# EAGLE design kelvin_ntc_B (EAGLE 6.6.0)
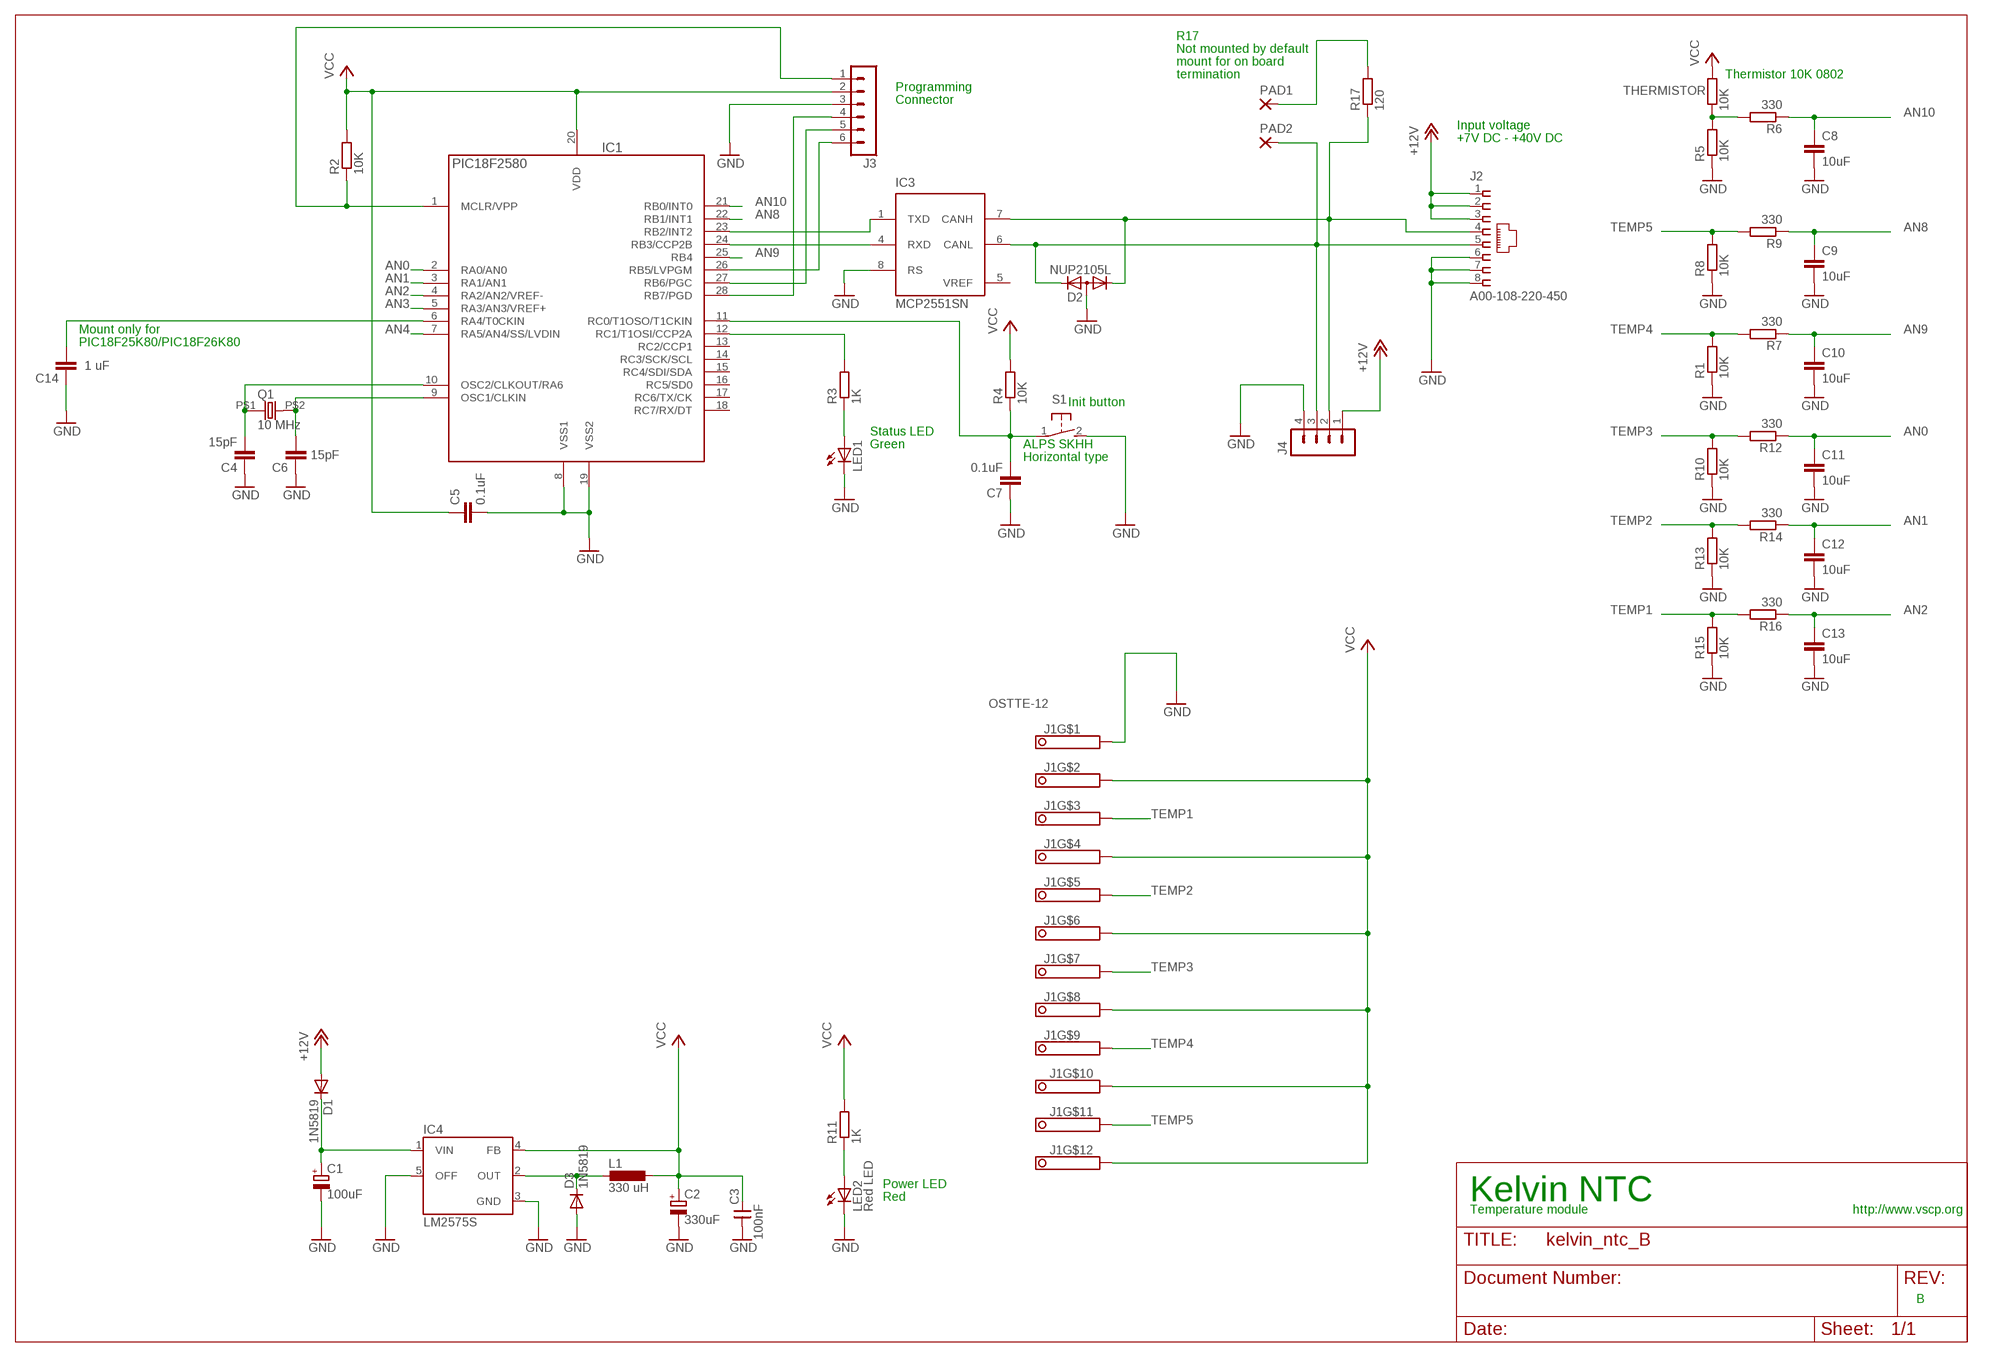
[diagram p0: schematic, sheet 1]

## Parts
C1  100uF  CPOL-EUD  [PANASONIC_D]
C2  330uF  CPOL-EUD  [PANASONIC_D]
C3  100nF  CNP-0805  [0805]
C4  15pF  C-EUC0805  [C0805]
C5  0.1uF  C-EUC0805  [C0805]
C6  15pF  C-EUC0805  [C0805]
C7  0.1uF  C-EUC0805  [C0805]
C8  10uF  C-EUC0805  [C0805]
C9  10uF  C-EUC0805  [C0805]
C10  10uF  C-EUC0805  [C0805]
C11  10uF  C-EUC0805  [C0805]
C12  10uF  C-EUC0805  [C0805]
C13  10uF  C-EUC0805  [C0805]
C14  1 uF  C-EUC0805  [C0805]
D1  1N5819  DIODE-SOD123  [SOD123]
D2  NUP2105L  DIODE-2CA|ACSOT23  [SOT23]
D3  1N5819  DIODE-SOD123  [SOD123]
IC1  PIC18F2580  PIC18LF252-I/SO  [SO28]
IC3  MCP2551SN  [SO-08]
IC4  LM2575S  [TO263-5]
J1  OSTTE-12  [PINHEAD-12]
J2  A00-108-220-450  [RJ-45]
J3  MA06-1  [MA06-1]
J4  MA04-1  [MA04-1]
L1  330 uH  DO3316P  [DO3316P]
LED1  LEDCHIP-LED0805  [CHIP-LED0805]
LED2  Red LED  LEDCHIP-LED0805  [CHIP-LED0805]
PAD1  1,6/0,8  [1,6/0,8]
PAD2  1,6/0,8  [1,6/0,8]
Q1  10 MHz  HC-49S  [9C]
R1  10K  R-EU_R0805  [R0805]
R2  10K  R-EU_R0805  [R0805]
R3  1K  R-EU_R0805  [R0805]
R4  10K  R-EU_R0805  [R0805]
R5  10K  R-EU_R0805  [R0805]
R6  330  R-EU_R0805  [R0805]
R7  330  R-EU_R0805  [R0805]
R8  10K  R-EU_R0805  [R0805]
R9  330  R-EU_R0805  [R0805]
R10  10K  R-EU_R0805  [R0805]
R11  1K  R-EU_R0805  [R0805]
R12  330  R-EU_R0805  [R0805]
R13  10K  R-EU_R0805  [R0805]
R14  330  R-EU_R0805  [R0805]
R15  10K  R-EU_R0805  [R0805]
R16  330  R-EU_R0805  [R0805]
R17  120  R-EU_R0805  [R0805]
S1  31-XX  [B3F-31XX]
THERMISTOR  10K  R-EU_R0805  [R0805]

## Nets
+12V: D1.A J2.1 J2.2 J2.3 J4.1
AN0: C11.1 IC1.2(RA0/AN0) R12.1
AN1: C12.1 IC1.3(RA1/AN1) R14.1
AN2: C13.1 IC1.4(RA2/AN2/VREF-) R16.1
AN3: IC1.5(RA3/AN3/VREF+)
AN4: IC1.7(RA5/AN4/SS/LVDIN)
AN8: C9.1 IC1.22(RB1/INT1) R9.1
AN9: C10.1 IC1.25(RB4) R7.1
AN10: C8.1 IC1.21(RB0/INT0) R6.1
CANH: D2.1(K1) IC3.7(CANH) J2.4 J4.2 R17.1
CANL: D2.2(K2) IC3.6(CANL) J2.5 J4.3 PAD2.1(P)
GND: C1.- C2.- C3.1 C4.1 C5.2 C6.1 C7.1 C8.2 C9.2 C10.2 C11.2 C12.2 C13.2 C14.1 D2.3(A) D3.A IC1.8(VSS1) IC1.19(VSS2) IC3.8(RS) IC4.3(GND) IC4.5(OFF) J1.1 J2.6 J2.7 J2.8 J3.3 J4.4 LED1.C LED2.C R1.1 R5.1 R8.1 R10.1 R13.1 R15.1 S1.2(S)
N$1: D3.C IC4.2(OUT) L1.1
N$2: C4.2 IC1.10(OSC2/CLKOUT/RA6) Q1.P$1
N$3: C1.+ D1.C IC4.1(VIN)
N$4: IC1.12(RC1/T1OSI/CCP2A) R3.2
N$5: LED1.A R3.1
N$6: C7.2 IC1.11(RC0/T1OSO/T1CKIN) R4.1 S1.1(P)
N$7: C6.2 IC1.9(OSC1/CLKIN) Q1.P$2
N$8: R5.2 R6.2 THERMISTOR.1
N$9: C14.2 IC1.6(RA4/T0CKIN)
N$11: PAD1.1(P) R17.2
N$12: IC1.1(MCLR/VPP) J3.1 R2.1
N$13: IC1.28(RB7/PGD) J3.4
N$14: IC1.27(RB6/PGC) J3.5
N$15: IC1.26(RB5/LVPGM) J3.6
N$20: LED2.A R11.1
RXCAN: IC1.24(RB3/CCP2B) IC3.4(RXD)
TEMP1: J1.3 R15.2 R16.2
TEMP2: J1.5 R13.2 R14.2
TEMP3: J1.7 R10.2 R12.2
TEMP4: J1.9 R1.2 R7.2
TEMP5: J1.11 R8.2 R9.2
TXCAN: IC1.23(RB2/INT2) IC3.1(TXD)
VCC: C2.+ C3.2 C5.1 IC1.20(VDD) IC4.4(FB) J1.2 J1.4 J1.6 J1.8 J1.10 J1.12 J3.2 L1.2 R2.2 R4.2 R11.2 THERMISTOR.2
Unconnected: IC1.13(RC2/CCP1) IC1.14(RC3/SCK/SCL) IC1.15(RC4/SDI/SDA) IC1.16(RC5/SD0) IC1.17(RC6/TX/CK) IC1.18(RC7/RX/DT)

## Notes on the sheet
- R17
- Not mounted by default
- mount for on board
- termination | Thermistor 10K 0802
- Programming
- Connector
- Input voltage
- +7V DC - +40V DC
- Mount only for
- PIC18F25K80/PIC18F26K80
- Init button
- Status LED
- Green | ALPS SKHH
- Horizontal type
- Power LED
- Red | Kelvin NTC
- Temperature module | http://www.vscp.org
- B

## Power pins joined to a net without a drawn wire
GND: IC3.2(VSS)
VCC: IC3.3(VDD)
VREF: IC3.5(VREF)

## Library data of the parts
C1 C2 = rcl:CPOL-EU: POLARIZED CAPACITOR, European symbol
C3 = cap-master:CNP-: NON-POLARIZED CAP
C4-C14 = rcl:C-EU: CAPACITOR, European symbol
D1 D3 = diode:DIODE-: DIODE
D2 = diode:DIODE-2CA|AC: Dual DIODE Cathode-Anode|Anode-Cathode
IC1 = pic_olin:PIC18*F252-?: 18F252, 28 pin, 32Kb prog, 1536 data, 256 EEPROM
IC3 = microchip_can:MCP2551: High Speed CAN tranceiver
IC4 = v-reg-3:LM2575: National Semiconductor <http://www.national.com> 1.0A "Simple Switcher"(c) 52kHz, Vout 1.23-37V (HV: 57V), Vin 40V (HV: 60V), 50µA standby current
J1 = vscpcan:OSTTE-12
J2 = vscpcan:A00-108-220-450
J3 = con-lstb:MA06-1: PIN HEADER; OC_FARNELL: unknown; OC_NEWARK: unknown
J4 = con-lstb:MA04-1: PIN HEADER; OC_FARNELL: unknown; OC_NEWARK: unknown
L1 = inductor-coilcraft:DO3316P: COILCRAFT; OC_FARNELL: unknown; OC_NEWARK: unknown
LED1 LED2 = led:LED: LED OSRAM: - CHIPLED LG R971, LG N971, LY N971, LG Q971, LY Q971, LO R971, LY R971 LH N974, LH R974 LS Q976, LO Q976, LY Q976 LO Q996 - Hyper CHIPLED LW Q18S LB Q993, LB Q99A, LB R99A - SideLED LS A670, LO A670, LY A670, LG A670, LP A670 LB A673, LV A673, LT A673, LW A673 LH A674 LY A675 LS A676, LA A676, LO A676, LY A676, LW A676 LS A679, LY A679, LG A679 - Hyper Micro SIDELED® LS Y876, LA Y876, LO Y876, LY Y876 LT Y87S - SmartLED LW L88C, LW L88S LB L89C, LB L89S, LG L890 LS L89K, LO L89K, LY L89K LS L896, LA L896, LO L896, LY L896 - TOPLED LS T670, LO T670, LY T670, LG T670, LP T670 LSG T670, LSP T670, LSY T670, LOP T670, LYG T670 LG T671, LOG T671, LSG T671 LB T673, LV T673, LT T673, LW T673 LH T674 LS T676, LA T676, LO T676, LY T676, LB T676, LH T676, LSB T676, LW T676 LB T67C, LV T67C, LT T67C, LS T67K, LO T67K, LY T67K, LW E67C LS E67B, LA E67B, LO E67B, LY E67B, LB E67C, LV E67C, LT E67C LW T67C LS T679, LY T679, LG T679 LS T770, LO T770, LY T770, LG T770, LP T770 LB T773, LV T773, LT T773, LW T773 LH T774 LS E675, LA E675, LY E675, LS T675 LS T776, LA T776, LO T776, LY T776, LB T776 LHGB T686 LT T68C, LB T68C - Hyper Mini TOPLED® LB M676 - Mini TOPLED Santana® LG M470 LS M47K, LO M47K, LY M47K Source: http://www.osram.convergy.de LUXEON: - LUMILED® LXK2-PW12-R00, LXK2-PW12-S00, LXK2-PW14-U00, LXK2-PW14-V00 LXK2-PM12-R00, LXK2-PM12-S00, LXK2-PM14-U00 LXK2-PE12-Q00, LXK2-PE12-R00, LXK2-PE12-S00, LXK2-PE14-T00, LXK2-PE14-U00 LXK2-PB12-K00, LXK2-PB12-L00, LXK2-PB12-M00, LXK2-PB14-N00, LXK2-PB14-P00, LXK2-PB14-Q00 LXK2-PR12-L00, LXK2-PR12-M00, LXK2-PR14-Q00, LXK2-PR14-R00 LXK2-PD12-Q00, LXK2-PD12-R00, LXK2-PD12-S00 LXK2-PH12-R00, LXK2-PH12-S00 LXK2-PL12-P00, LXK2-PL12-Q00, LXK2-PL12-R00 Source: www.luxeon.com KINGBRIGHT: KA-3528ASYC Source: www.kingbright.com
PAD1 PAD2 = wirepad:1,6/0,8: THROUGH-HOLE PAD
Q1 = vscpcan:HC-49S: Digikey 887-1050-1-nd
R1-R17 THERMISTOR = rcl:R-EU_: RESISTOR, European symbol
S1 = switch-omron:31-XX: OMRON SWITCH; MPN: B3F-3100; OC_FARNELL: 959704; OC_NEWARK: 36M3582

## Board
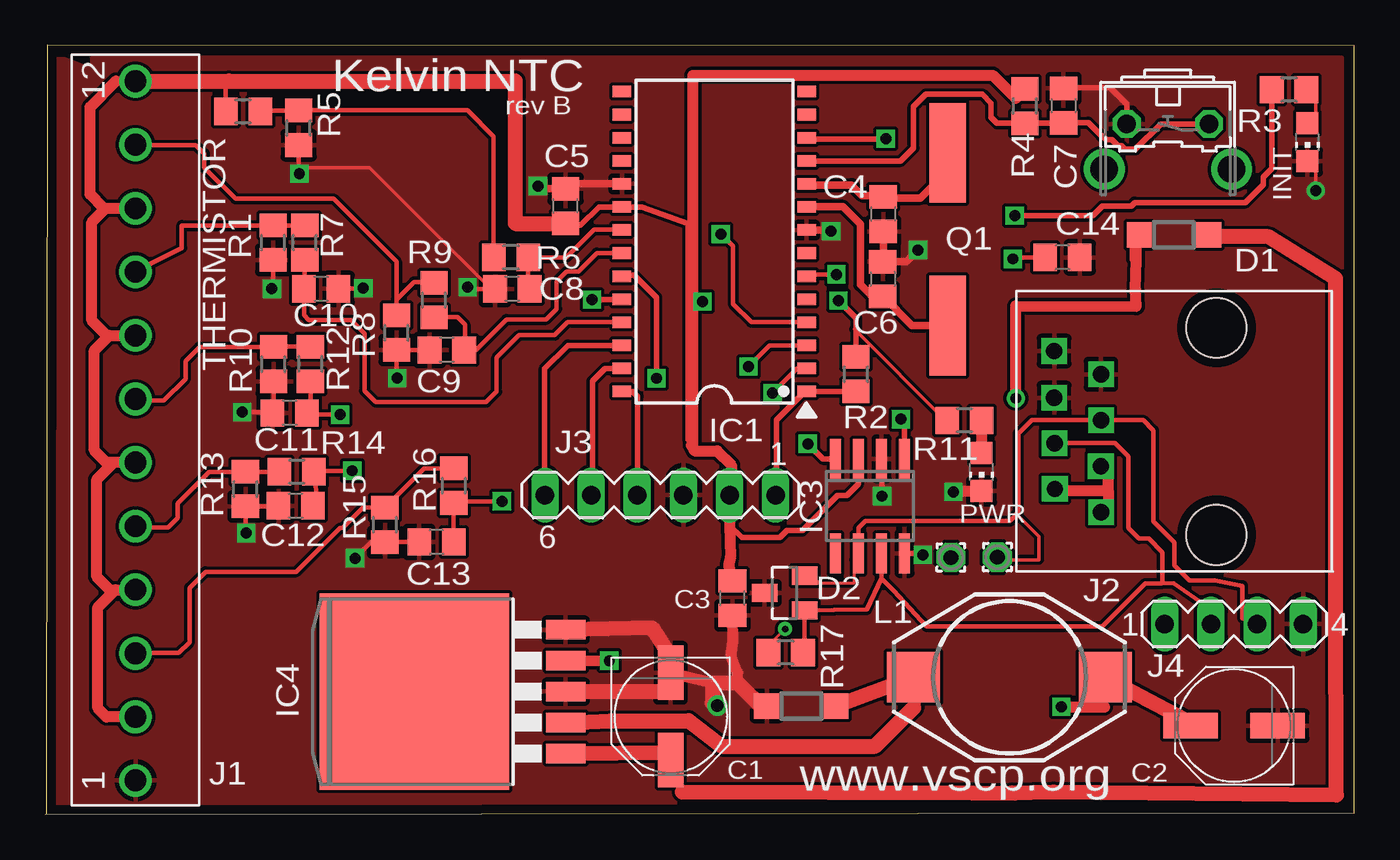
[diagram p1: board, top side]
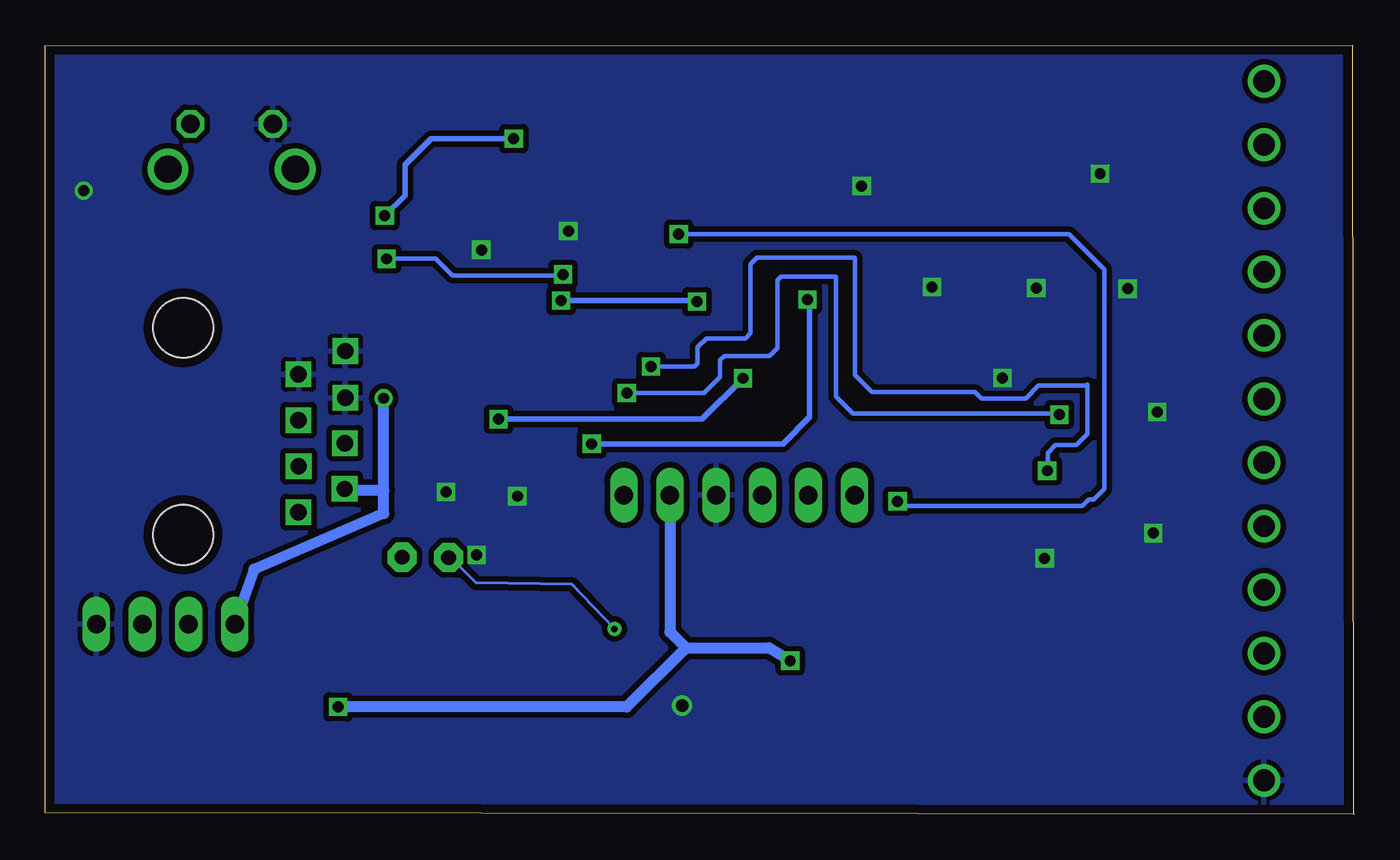
[diagram p2: board, bottom side, seen from below]

Size 72.04 x 42.34 mm. Coordinates in mm from the lower left corner, seen from the top.
Outline: 0,0 72.04,0.09 72.04,42.31 0.09,42.34 0.04,0.01
Copper layers (1*16): Top 0.0356mm / dielectric 1.5011mm / Bottom 0.0356mm
Design rules "SilverCircuits": minimum track width 7mil, minimum drill 14mil, track to track 7mil, track to pad 7mil, pad to pad 7mil, via to via 7mil, smd to smd 0mil, copper to edge 20mil, drill to drill 8mil, minimum pad ring 10mil, minimum via ring 8mil, stop-mask expansion 4mil, vias tented up to drill 0mil, thermal gap 10mil

### Footprints (pad centres in the part's own frame; a part is rotated, then mirrored left to right if it is on the bottom)
PANASONIC_D = smd 3 x 1.4: + 2.4,0; - -2.4,0
0805 = smd 1.27 x 1.524: 1 -0.953,0; 2 0.953,0
C0805 = smd 1.3 x 1.5: 1 -0.95,0; 2 0.95,0
SOD123 = smd 1.4 x 1.4: A 1.9,0; C -1.9,0
SOT23 = smd 1 x 1.4: 1 -0.95,-1.1; 2 0.95,-1.1; 3 0,1.1
SO28 = smd 0.635 x 1.016: 1 -8.255,-5.08; 2 -6.985,-5.08; 3 -5.715,-5.08; 4 -4.445,-5.08; 5 -3.175,-5.08; 6 -1.905,-5.08; 7 -0.635,-5.08; 8 0.635,-5.08; 9 1.905,-5.08; 10 3.175,-5.08; 11 4.445,-5.08; 12 5.715,-5.08; 13 6.985,-5.08; 14 8.255,-5.08; 15 8.255,5.08; 16 6.985,5.08; 17 5.715,5.08; 18 4.445,5.08; 19 3.175,5.08; 20 1.905,5.08; 21 0.635,5.08; 22 -0.635,5.08; 23 -1.905,5.08; 24 -3.175,5.08; 25 -4.445,5.08; 26 -5.715,5.08; 27 -6.985,5.08; 28 -8.255,5.08
SO-08 = smd 0.6 x 2.2: 1 -1.905,-2.6; 2 -0.635,-2.6; 3 0.635,-2.6; 4 1.905,-2.6; 5 1.905,2.6; 6 0.635,2.6; 7 -0.635,2.6; 8 -1.905,2.6
TO263-5 = smd 1.067 x 2.159: 1 -3.404,-5.791; 2 -1.702,-5.791; 3 0,-5.791; 4 1.702,-5.791; 5 3.404,-5.791 | smd 10.8 x 10.41: 6 0,2.54
PINHEAD-12 = drill 1.2: 1 -17.5,0; 2 -14,0; 3 -10.5,0; 4 -7,0; 5 -3.5,0; 6 0,0; 7 3.5,0; 8 7,0; 9 10.5,0; 10 14,0; 11 17.5,0; 12 21,0
RJ-45 = drill 0.9 square: 1 -4.45,6.35; 2 -3.17,8.89; 3 -1.92,6.36; 4 -0.65,8.91; 5 0.62,6.35; 6 1.84,8.93; 7 3.14,6.35; 8 4.42,8.93 | hole 3.3: -5.7,0; 5.7,0
MA06-1 = drill 1.016 long: 1 -6.35,0; 2 -3.81,0; 3 -1.27,0; 4 1.27,0; 5 3.81,0; 6 6.35,0
MA04-1 = drill 1.016 long: 1 -3.81,0; 2 -1.27,0; 3 1.27,0; 4 3.81,0
DO3316P = smd 2.92 x 2.79: 1 -5.28,0; 2 5.28,0
CHIP-LED0805 = smd 1.2 x 1.2: A 0,-1.05; C 0,1.05
1,6/0,8 = drill 0.813 pad 1.6 octagon: 1 0,0
9C = smd 5.5 x 2: P$1 -4.74,0; P$2 4.76,0
R0805 = smd 1.3 x 1.5: 1 -0.95,0; 2 0.95,0
B3F-31XX = drill 1.016 octagon: 1 -2.261,-1.245; 2 2.261,-1.245 | drill 1.499 pad 2.159: 3 -3.505,1.245; 4 3.505,1.245

### Placement (x,y rotation side)
C1  34.42,5.39 270 top
C2  65.44,4.89 180 top
C3  37.82,11.91 90 top
C4  46.12,33.05 90 top
C5  28.63,33.49 90 top
C6  46.09,29.48 270 top
C7  56.05,39.02 270 top
C8  25.7,28.93 180 top
C9  22.1,25.57 180 top
C10  15.18,28.94 0 top
C11  13.45,22.1 180 top
C12  13.78,16.99 180 top
C13  21.53,15 180 top
C14  55.99,30.67 180 top
D1  62.12,31.91 180 top
D2  40.69,12.19 90 top
D3  41.61,5.96 180 top
IC1  36.82,31.54 90 top
IC3  45.39,16.98 180 top
IC4  22.85,6.76 90 top
J1  4.96,19.37 90 top
J2  64.46,21.09 90 top
J3  33.85,17.58 180 top
J4  65.43,10.48 0 top
L1  53.07,7.55 0 top
LED1  69.47,37.01 180 top
LED2  51.53,18.85 180 top
PAD1  49.84,14.14 0 top
PAD2  52.41,14.16 0 top
Q1  49.66,31.68 270 top
R1  12.53,31.48 90 top
R2  44.62,24.24 90 top
R3  68.46,39.9 180 top
R4  53.92,39 90 top
R5  13.94,37.8 90 top
R6  25.63,30.67 180 top
R7  14.28,31.48 90 top
R8  19.33,26.52 90 top
R9  21.39,28.32 90 top
R10  12.56,24.79 90 top
R11  50.59,21.69 180 top
R12  14.59,24.8 90 top
R13  11.01,17.91 90 top
R14  13.83,18.86 180 top
R15  18.69,15.94 90 top
R16  22.49,18.1 90 top
R17  40.75,8.91 180 top
S1  61.79,36.77 180 top
THERMISTOR  10.88,38.7 180 top

### Tracks (layer width: path | path; a pad name or v marks a point on that pad's centre or on a via)
+12V  (via drill 0.6)
  Top 0.203: J2.2 55.96,17.83 | D1.A 59.77,31.8 59.77,30.53 60.05,30.52
  Top 0.406: D1.A 59.9,31.89
  Top 0.61: 55.96,17.83 58.5,17.83 | 58.5,17.83 58.5,19.1 J2.3 | 58.5,17.83 58.5,16.56 J2.1 | 60.09,32.02 60.05,30.52 60.01,28.91 60.05,27.96 53.42,27.99 v53.42,22.91
  Bottom 0.203: 55.96,17.83 J2.2
  Bottom 0.61: 53.42,17.83 53.42,16.56 60.55,13.49 J4.1 | 53.42,17.83 v53.42,22.91 | 53.42,17.83 55.96,17.83
AN0  (via drill 0.6)
  Top 0.254: R12.1 14.59,22.29 C11.1 14.49,22.01 v16.22,22.01 | IC1.2 41.38,24.55 v40.03,23.2
  Bottom 0.254: v40.03,23.2 35.79,23.2 34.9,24.09 34.9,25.01 34.67,25.24 32.17,25.24 31.74,25.67 31.74,29.41 31.55,29.6 28.55,29.6 28.51,29.56 28.51,23.01 27.58,22.08 16.29,22.08 v16.22,22.01
AN1  (via drill 0.6)
  Top 0.254: C12.1 14.9,16.8 14.93,16.76 14.97,17.34 R14.1 14.84,18.92 v16.89,18.92 | IC1.3 39.86,25.82 v38.7,24.66
  Bottom 0.254: v38.7,24.66 36.3,24.66 36.14,24.82 36.14,25.72 35.66,26.2 33.51,26.2 33.22,26.49 33.22,30.31 32.87,30.66 27.51,30.66 27.48,30.63 27.48,24.18 26.55,23.25 20.87,23.25 20.52,22.9 18.07,22.9 17.37,23.6 14.75,23.6 14.68,23.67 14.68,20.94 15.29,20.33 16.44,20.33 16.86,19.91 16.86,18.95 v16.89,18.92
AN2  (via drill 0.6)
  Top 0.254: C13.1 R16.1 22.58,17.24 v25.13,17.24 | IC1.4 38.85,27.1 37.85,28.1 37.85,31.28 v37.18,31.95
  Bottom 0.254: 25.04,17.15 v25.13,17.24 24.88,16.99 14.97,16.99 14.61,17.35 14.33,17.35 13.75,17.93 13.75,29.99 15.71,31.95 v37.18,31.95
AN8
  Top 0.254: IC1.22 30.36,30.91 29.34,29.89 28.69,29.89 28.14,29.34 28.14,27.83 27.56,27.25 25.38,27.25 23.7,25.57 C9.1 23.09,25.61 23.09,26.98 22.7,27.37 R9.1
AN9
  Top 0.254: IC1.25 28.73,27.1 28.03,26.39 26.08,26.39 24.84,25.15 24.84,23.28 24.26,22.7 18.19,22.7 17.57,23.32 17.57,26.47 16.83,27.21 14.5,27.21 14.23,27.48 C10.1 14.28,28.99 R7.1
AN10
  Top 0.254: IC1.21 31.7,32.21 30.2,32.21 28.66,30.67 R6.1 26.58,29 C8.1
CANH
  Top 0.254: 46.02,13 IC3.7 | 46.02,13 46.69,12.33 48.51,10.35 58.18,10.35 60.54,12.71 61.45,12.71 61.49,12.75 | 61.49,12.75 61.49,14.43 60.74,15.18 60.2,15.18 59.61,15.77 59.61,19.71 58.88,20.44 J2.4 | 61.49,12.75 62.13,12.71 63.86,11.52 J4.2 | 46.02,13 46.01,12.98 45.21,11.28 43.42,11.25 D2.1 41.79,9 R17.1
  Top 0.305: IC3.7 46,14.36
CANL
  Top 0.178: 44.53,14.02 44.53,12.75 41.99,12.75 D2.2
  Top 0.203: D2.2 42.53,12.79 | 44.53,14.02 IC3.6 | PAD2.1 52.15,14.02 54.69,14.02 54.69,15.29 53.46,16.52 53.42,16.56
  Top 0.254: J4.3 65.89,10.8 65.89,12.58 64.37,12.88 62.98,12.88 62.14,13.72 62.14,14.98 61,16.12 61,21.14 60.43,21.71 J2.5 54.29,21.71 53.56,20.98 53.56,16.61 53.46,16.52 53.1,16.15 45.14,16.15 44.75,15.76 IC3.6
GND  (via drill 0.6, 0.7)
  Top 0.203: v69.93,34.34 69.93,35.61 LED1.C | C8.2 24.21,29.26 17.86,35.61 14.05,35.61 v13.98,35.28
  Top 0.254: 36.71,7.23 36.71,7.41 | C8.2 23.34,28.93 v23.24,29.03 | R5.1 13.94,35.55 v13.98,35.28 | C9.2 R8.1 19.33,24.05 v19.36,24.02 | R1.1 12.54,28.84 v12.46,28.94 | C10.2 17.46,28.94 v17.5,28.98 | R10.1 12.56,22.16 C11.2 12.44,22.16 v10.83,22.16 | v11.05,15.49 11.01,15.53 R13.1 12.7,16.96 C12.2 | v17.04,14.1 17.93,14.99 R15.1 C13.2
  Top 0.305: IC3.8 48.22,14.38 v48.31,14.29 | v46.06,17.52 46.06,19.55 IC3.2 | S1.2 59.53,39.11 58.63,40.01 56.09,40.01 C7.1
  Top 0.406: IC1.19 28.9,34.71 C5.2 27.27,34.44 v27.11,34.6 | 46.05,32.17 C4.1 46.12,30.46 C6.1 47.39,30.43 v48.04,31.08 | IC1.8 43.18,32.17 v43.25,32.11
  Top 0.61: 34.73,6.77 34.41,6.7 34.7,7.26 34.73,7.23 | 34.73,7.23 34.78,7.18 | 34.73,7.23 C1.- | 39.5,5.83 39.41,5.93 D3.A 39.55,5.96 | C1.- 36.71,7.23 | 39.55,5.96 39.66,5.86 | 39.55,5.96 39.01,6.51 | 34.52,7.2 34.42,7.1 | C1.- 34.52,7.2 | 34.55,8.5 34.55,7.23 34.52,7.2 | 36.71,6.14 v36.99,5.99 | 38.1,7.23 38.1,7.79 37.74,8.73 37.84,9.53 C3.1 | 50.03,17.8 LED2.C
  Top 0.813: IC4.3 34.73,6.77 | 39.41,5.93 38.1,7.23 36.71,7.23 36.71,6.14 | IC4.5 33.42,10.26 34.55,8.5
  other vias: 49.98,17.75
  pour Bottom (isolate 0.305): -0.22,1.63 1.44,-1.72 71.42,-2.09 73.46,1.28 73.18,34.45 71.6,43.71 0.21,43.61 -0.71,34.03
  pour Top: 1.05,41.57 0.64,41.57 0.64,0.37 71.68,0.37 71.68,0.86 71.36,0.86 71.36,41.65 2.58,41.65 2.58,41
N$1
  Top 0.61: 47.91,5.91 47.86,5.96 L1.1 47.79,5.86 | IC4.2 28.73,5 28.61,4.94
  Top 0.813: L1.1 D3.C | 47.79,5.86 45.68,3.75 37.24,3.75 35.43,5.16 31.1,5.15 28.69,5.05 28.73,5
N$2
  Top 0.406: Q1.P$1 49.66,35.42 48.18,33.94 45.74,33.94 45.6,34.08 | 45.6,34.08 46.04,34.08 C4.2 | 45.6,34.08 44.95,34.08 44.38,34.65 41.96,34.65 IC1.10
N$3
  Top 0.406: 34.43,3.41 C1.+ 35.05,1.23 | D1.C 64.56,31.91 64.66,31.81
  Top 0.813: IC4.1 34.43,3.41 | 64.66,31.81 67.33,31.81 71.03,29.51 71.03,12.1 71.06,1.07 55.5,1.23 53.15,1.18 53.37,1.17 51.05,1.18 35.05,1.23
N$4  (via drill 0.6)
  Top 0.305: IC1.12 42,37.25 42.09,37.17 46.22,37.17 v46.26,37.21 | v53.36,32.97 57.66,32.97 58.18,33.49 59.77,33.49 59.97,33.69 66.06,33.69 67.04,34.67 67.04,35.09 67.51,35.56 R3.2
  Bottom 0.305: v46.26,37.21 50.81,37.21 52.25,35.77 52.25,34.08 v53.36,32.97
N$5
  Top 0.203: 69.93,39.42 69.93,38.15 LED1.A
  Top 0.254: 69.93,39.42 R3.1
N$6
  Top 0.305: IC1.11 41.91,35.97 47.07,35.97 47.79,36.69 47.79,38.97 48.47,39.65 51.57,39.65 52.06,39.16 52.06,38.38 52.39,38.05 R4.1 56.03,38.05 C7.2 56.07,38.09 57.4,38.09 58.15,37.34 58.21,37.34 58.41,37.14 58.7,37.14 59.03,36.81 59.22,36.81 59.41,36.62 60,36.62 61.39,38.02 S1.1
N$7
  Top 0.406: Q1.P$2 47.7,26.92 C6.2 45.49,28.53 44.86,29.16 44.86,32.5 43.91,33.45 IC1.9
N$8
  Top 0.254: THERMISTOR.1 11.88,38.75 R5.2 23.24,38.76 24.68,37.32 R6.2
N$9  (via drill 0.6)
  Top 0.254: C14.2 53.34,30.67 v53.26,30.59 | v43.55,29.73 41.99,29.73 IC1.6
  Bottom 0.254: v53.26,30.59 50.55,30.59 49.63,29.67 43.61,29.67 v43.55,29.73
N$11  (via drill 0.36)
  Top 0.178: v40.72,10.21 39.45,8.94 R17.2
  Bottom 0.178: v40.72,10.21 43.06,12.65 48.34,12.75 49.61,14.02 PAD1.1
N$12
  Top 0.305: IC1.1 R2.1 41.82,23.29 40.24,21.71 40.24,17.62 J3.1
N$13
  Top 0.305: IC1.28 32.32,23.29 32.6,23.01 32.6,17.6 J3.4
N$14
  Top 0.305: IC1.27 30.81,24.55 30.11,23.85 30.11,17.65 J3.5
N$15
  Top 0.305: IC1.26 28.76,25.82 27.49,24.55 J3.6
N$20
  Top 0.61: R11.1 LED2.A
RXCAN  (via drill 0.6)
  Top 0.305: IC3.4 42.79,19.58 v41.97,20.4 | v30.09,28.35 31.72,28.35 IC1.24
  Bottom 0.305: v41.97,20.4 31.45,20.4 29.98,21.87 29.98,28.24 v30.09,28.35
TEMP1
  Top 0.254: R16.2 20.85,19.05 R15.2 17.48,16.89 16.35,15.76 16.21,15.76 13.81,13.36 8.82,13.36 7.94,12.48 7.94,9.48 7.34,8.88 J1.3
TEMP2
  Top 0.254: R14.2 R13.2 9.01,18.86 7.27,17.12 7.27,16.33 6.75,15.81 5.02,15.81 J1.5
TEMP3
  Top 0.254: J1.7 5.05,22.78 6.51,22.78 7.71,23.98 7.71,24.97 8.48,25.74 R10.2 R12.2
TEMP4
  Top 0.254: J1.9 5.03,29.94 7.51,31.18 7.51,32.43 R1.2 R7.2
TEMP5
  Top 0.254: R9.2 21.35,29.31 20.29,29.31 19.33,28.35 R8.2 19.33,30.43 15.86,33.9 10.46,33.9 8.75,35.61 8.75,36.39 8.28,36.86 J1.11
TXCAN  (via drill 0.6)
  Top 0.305: IC3.1 47.3,21.55 v47.09,21.76 | v33.64,24.01 33.64,28.46 32.4,29.7 31.8,29.7 IC1.23
  Bottom 0.305: v47.09,21.76 35.89,21.76 v33.64,24.01
VCC  (via drill 0.6)
  Top 0.203: R11.2 49.61,21.64 44.53,26.72 44.62,26.72
  Top 0.254: 35.56,20.32 35.64,20.37 | THERMISTOR.2 9.93,40.22 10.09,40.38
  Top 0.305: C5.1 28.73,32.44 29.46,32.44 30.46,33.45 IC1.20 32.84,33.45 35.38,32.53 35.38,28.13 | 35.38,28.13 35.38,20.63 35.56,20.32 | 37.76,17.68 J3.2 | v31.04,8.46 30.94,8.41 | IC3.3 44.75,18.2 44.11,17.55 43.59,17.55 41.67,15.63 40.82,15.63 40.43,15.24 38.34,15.24 37.66,15.92 | 58.3,5.92 L1.2 | R2.2 44.62,26.72 44.62,27.33 v43.66,28.29 | v36.17,28.24 35.49,28.24 35.38,28.13
  Top 0.406: 63.13,5 C2.+ | J1.12 3.88,40.37 | 3.21,33.39 4.94,33.39 J1.10 | 3.35,26.39 4.94,26.39 J1.8 | J1.6 3.75,19.37 | 4.92,12.33 J1.4 3.85,12.37
  Top 0.61: 35.56,20.32 35.74,20.01 36.98,20.01 37.76,19.23 37.76,17.68 | 30.94,8.41 IC4.4 | C3.2 37.61,13.7 37.71,14.17 37.66,15.92 J3.2 | v55.93,5.92 58.3,5.92 | 35.64,20.37 35.64,40.69 52.15,40.69 53.42,39.42 R4.2 | 3.88,40.37 2.46,38.95 2.46,34.14 3.21,33.39 | J1.10 3.32,33.37 2.55,32.6 2.55,27.19 3.35,26.39 | J1.8 3.51,26.37 2.69,25.55 2.69,20.04 3.35,19.38 J1.6 | 3.75,19.37 2.83,18.45 2.83,13.08 3.58,12.33 4.92,12.33 | 3.85,12.37 2.88,11.4 2.88,5.84 3.35,5.37 J1.2
  Top 0.813: L1.2 63.13,5 | C5.1 25.86,32.54 25.86,40.38 10.09,40.38 J1.12
  Bottom 0.305: v43.66,28.29 36.22,28.29 v36.17,28.24
  Bottom 0.61: J3.2 37.66,10.04 36.79,9.17 | 36.79,9.17 32.22,9.17 v31.04,8.46 | v55.93,5.92 40.04,5.92 36.79,9.17

### Text on the board
tNames: Kelvin NTC | rev B | INIT | PWR | www.vscp.org